# Altium project RESET_BOARD_OVER_RF24.PrjPcb
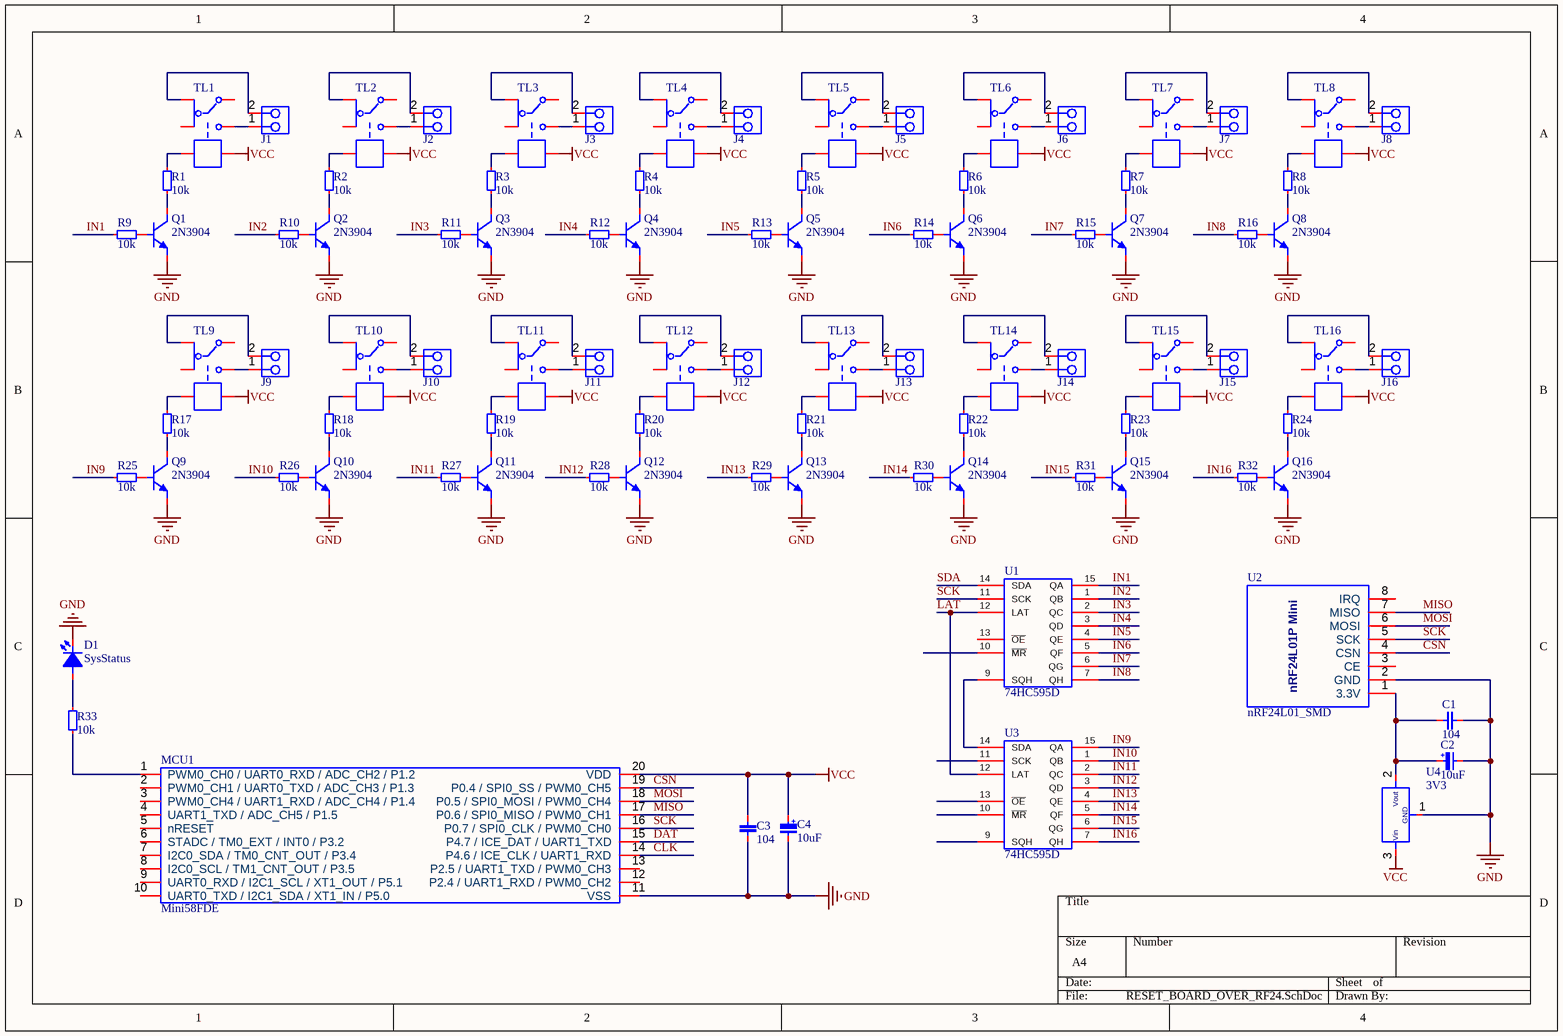
[diagram p0: RESET_BOARD_OVER_RF24.SchDoc]
1 sheet, 91 parts. Net scope: global (net labels, ports and power ports of the same name join across sheets).

## Sheet RESET_BOARD_OVER_RF24.SchDoc
size A4; SheetNumber: 1; SheetTotal: 1

### Parts
C1  104  [C1206]
C2  10uF  [CAP_RAD_D05x11]
C3  104  [C0805]
C4  10uF  [CAP_RAD_D05x11]
D1  SysStatus  [L0805RED]
J1  JST - XH - Thru (R) - 2.54mm  [JST - XH - Thru (R) - 2Pin - 2.54mm]  (value not drawn)
J2  JST - XH - Thru (R) - 2.54mm  [JST - XH - Thru (R) - 2Pin - 2.54mm]  (value not drawn)
J3  JST - XH - Thru (R) - 2.54mm  [JST - XH - Thru (R) - 2Pin - 2.54mm]  (value not drawn)
J4  JST - XH - Thru (R) - 2.54mm  [JST - XH - Thru (R) - 2Pin - 2.54mm]  (value not drawn)
J5  JST - XH - Thru (R) - 2.54mm  [JST - XH - Thru (R) - 2Pin - 2.54mm]  (value not drawn)
J6  JST - XH - Thru (R) - 2.54mm  [JST - XH - Thru (R) - 2Pin - 2.54mm]  (value not drawn)
J7  JST - XH - Thru (R) - 2.54mm  [JST - XH - Thru (R) - 2Pin - 2.54mm]  (value not drawn)
J8  JST - XH - Thru (R) - 2.54mm  [JST - XH - Thru (R) - 2Pin - 2.54mm]  (value not drawn)
J9  JST - XH - Thru (R) - 2.54mm  [JST - XH - Thru (R) - 2Pin - 2.54mm]  (value not drawn)
J10  JST - XH - Thru (R) - 2.54mm  [JST - XH - Thru (R) - 2Pin - 2.54mm]  (value not drawn)
J11  JST - XH - Thru (R) - 2.54mm  [JST - XH - Thru (R) - 2Pin - 2.54mm]  (value not drawn)
J12  JST - XH - Thru (R) - 2.54mm  [JST - XH - Thru (R) - 2Pin - 2.54mm]  (value not drawn)
J13  JST - XH - Thru (R) - 2.54mm  [JST - XH - Thru (R) - 2Pin - 2.54mm]  (value not drawn)
J14  JST - XH - Thru (R) - 2.54mm  [JST - XH - Thru (R) - 2Pin - 2.54mm]  (value not drawn)
J15  JST - XH - Thru (R) - 2.54mm  [JST - XH - Thru (R) - 2Pin - 2.54mm]  (value not drawn)
J16  JST - XH - Thru (R) - 2.54mm  [JST - XH - Thru (R) - 2Pin - 2.54mm]  (value not drawn)
MCU1  Mini58FDE  [TSSOP20_0.65_4.4]
Q1  2N3904  [SOT23-3]
Q2  2N3904  [SOT23-3]
Q3  2N3904  [SOT23-3]
Q4  2N3904  [SOT23-3]
Q5  2N3904  [SOT23-3]
Q6  2N3904  [SOT23-3]
Q7  2N3904  [SOT23-3]
Q8  2N3904  [SOT23-3]
Q9  2N3904  [SOT23-3]
Q10  2N3904  [SOT23-3]
Q11  2N3904  [SOT23-3]
Q12  2N3904  [SOT23-3]
Q13  2N3904  [SOT23-3]
Q14  2N3904  [SOT23-3]
Q15  2N3904  [SOT23-3]
Q16  2N3904  [SOT23-3]
R1  10k  [R0805]
R2  10k  [R0805]
R3  10k  [R0805]
R4  10k  [R0805]
R5  10k  [R0805]
R6  10k  [R0805]
R7  10k  [R0805]
R8  10k  [R0805]
R9  10k  [R0805]
R10  10k  [R0805]
R11  10k  [R0805]
R12  10k  [R0805]
R13  10k  [R0805]
R14  10k  [R0805]
R15  10k  [R0805]
R16  10k  [R0805]
R17  10k  [R0805]
R18  10k  [R0805]
R19  10k  [R0805]
R20  10k  [R0805]
R21  10k  [R0805]
R22  10k  [R0805]
R23  10k  [R0805]
R24  10k  [R0805]
R25  10k  [R0805]
R26  10k  [R0805]
R27  10k  [R0805]
R28  10k  [R0805]
R29  10k  [R0805]
R30  10k  [R0805]
R31  10k  [R0805]
R32  10k  [R0805]
R33  10k  [R0805]
TL1  HK4100F-DC3V-SHG  [RELAY-HK4100F-DC3V-SHG]  (value not drawn)
TL2  HK4100F-DC3V-SHG  [RELAY-HK4100F-DC3V-SHG]  (value not drawn)
TL3  HK4100F-DC3V-SHG  [RELAY-HK4100F-DC3V-SHG]  (value not drawn)
TL4  HK4100F-DC3V-SHG  [RELAY-HK4100F-DC3V-SHG]  (value not drawn)
TL5  HK4100F-DC3V-SHG  [RELAY-HK4100F-DC3V-SHG]  (value not drawn)
TL6  HK4100F-DC3V-SHG  [RELAY-HK4100F-DC3V-SHG]  (value not drawn)
TL7  HK4100F-DC3V-SHG  [RELAY-HK4100F-DC3V-SHG]  (value not drawn)
TL8  HK4100F-DC3V-SHG  [RELAY-HK4100F-DC3V-SHG]  (value not drawn)
TL9  HK4100F-DC3V-SHG  [RELAY-HK4100F-DC3V-SHG]  (value not drawn)
TL10  HK4100F-DC3V-SHG  [RELAY-HK4100F-DC3V-SHG]  (value not drawn)
TL11  HK4100F-DC3V-SHG  [RELAY-HK4100F-DC3V-SHG]  (value not drawn)
TL12  HK4100F-DC3V-SHG  [RELAY-HK4100F-DC3V-SHG]  (value not drawn)
TL13  HK4100F-DC3V-SHG  [RELAY-HK4100F-DC3V-SHG]  (value not drawn)
TL14  HK4100F-DC3V-SHG  [RELAY-HK4100F-DC3V-SHG]  (value not drawn)
TL15  HK4100F-DC3V-SHG  [RELAY-HK4100F-DC3V-SHG]  (value not drawn)
TL16  HK4100F-DC3V-SHG  [RELAY-HK4100F-DC3V-SHG]  (value not drawn)
U1  74HC595D  [SO16]
U2  nRF24L01_SMD  [NRF24L01Mini]
U3  74HC595D  [SO16]
U4  3V3  [SOT223-3]

### Nets
GND: C1.1 C2.2 C3.1 C4.2 D1.2(K) MCU1.11(VSS) Q1.2(E) Q2.2(E) Q3.2(E) Q4.2(E) Q5.2(E) Q6.2(E) Q7.2(E) Q8.2(E) Q9.2(E) Q10.2(E) Q11.2(E) Q12.2(E) Q13.2(E) Q14.2(E) Q15.2(E) Q16.2(E) U1.8 U2.2(GND) U3.8 U4.1
VCC: C3.2 C4.1 MCU1.20(VDD) TL1.5 TL2.5 TL3.5 TL4.5 TL5.5 TL6.5 TL7.5 TL8.5 TL9.5 TL10.5 TL11.5 TL12.5 TL13.5 TL14.5 TL15.5 TL16.5 U1.16 U3.16 U4.3
CLK: MCU1.14(P4.6_/_ICE_CLK_/_UART1_RXD)
CSN: MCU1.19(P0.4_/_SPI0_SS_/_PWM0_CH5) U2.4(CSN)
DAT: MCU1.15(P4.7_/_ICE_DAT_/_UART1_TXD)
IN1: R9.1 U1.15(QA)
IN2: R10.1 U1.1(QB)
IN3: R11.1 U1.2(QC)
IN4: R12.1 U1.3(QD)
IN5: R13.1 U1.4(QE)
IN6: R14.1 U1.5(QF)
IN7: R15.1 U1.6(QG)
IN8: R16.1 U1.7(QH)
IN9: R25.1 U3.15(QA)
IN10: R26.1 U3.1(QB)
IN11: R27.1 U3.2(QC)
IN12: R28.1 U3.3(QD)
IN13: R29.1 U3.4(QE)
IN14: R30.1 U3.5(QF)
IN15: R31.1 U3.6(QG)
IN16: R32.1 U3.7(QH)
LAT: U1.12(LAT) U3.12(LAT)
MISO: MCU1.17(P0.6_/_SPI0_MISO_/_PWM0_CH1) U2.7(MISO)
MOSI: MCU1.18(P0.5_/_SPI0_MOSI_/_PWM0_CH4) U2.6(MOSI)
SCK: MCU1.16(P0.7_/_SPI0_CLK_/_PWM0_CH0) U1.11(SCK) U2.5(SCK)
SDA: U1.14(SDA)
NetC1_2: C1.2 C2.1 U2.1(3.3V) U4.2
NetD1_1: D1.1(A) R33.1
NetJ1_1: J1.1 TL1.3
NetJ1_2: J1.2 TL1.1
NetJ2_1: J2.1 TL2.3
NetJ2_2: J2.2 TL2.1
NetJ3_1: J3.1 TL3.3
NetJ3_2: J3.2 TL3.1
NetJ4_1: J4.1 TL4.3
NetJ4_2: J4.2 TL4.1
NetJ5_1: J5.1 TL5.3
NetJ5_2: J5.2 TL5.1
NetJ6_1: J6.1 TL6.3
NetJ6_2: J6.2 TL6.1
NetJ7_1: J7.1 TL7.3
NetJ7_2: J7.2 TL7.1
NetJ8_1: J8.1 TL8.3
NetJ8_2: J8.2 TL8.1
NetJ9_1: J9.1 TL9.3
NetJ9_2: J9.2 TL9.1
NetJ10_1: J10.1 TL10.3
NetJ10_2: J10.2 TL10.1
NetJ11_1: J11.1 TL11.3
NetJ11_2: J11.2 TL11.1
NetJ12_1: J12.1 TL12.3
NetJ12_2: J12.2 TL12.1
NetJ13_1: J13.1 TL13.3
NetJ13_2: J13.2 TL13.1
NetJ14_1: J14.1 TL14.3
NetJ14_2: J14.2 TL14.1
NetJ15_1: J15.1 TL15.3
NetJ15_2: J15.2 TL15.1
NetJ16_1: J16.1 TL16.3
NetJ16_2: J16.2 TL16.1
NetMCU1_1: MCU1.1(PWM0_CH0_/_UART0_RXD_/_ADC_CH2_/_P1.2) R33.2
NetQ1_1: Q1.1(B) R9.2
NetQ1_3: Q1.3(C) R1.1
NetQ2_1: Q2.1(B) R10.2
NetQ2_3: Q2.3(C) R2.1
NetQ3_1: Q3.1(B) R11.2
NetQ3_3: Q3.3(C) R3.1
NetQ4_1: Q4.1(B) R12.2
NetQ4_3: Q4.3(C) R4.1
NetQ5_1: Q5.1(B) R13.2
NetQ5_3: Q5.3(C) R5.1
NetQ6_1: Q6.1(B) R14.2
NetQ6_3: Q6.3(C) R6.1
NetQ7_1: Q7.1(B) R15.2
NetQ7_3: Q7.3(C) R7.1
NetQ8_1: Q8.1(B) R16.2
NetQ8_3: Q8.3(C) R8.1
NetQ9_1: Q9.1(B) R25.2
NetQ9_3: Q9.3(C) R17.1
NetQ10_1: Q10.1(B) R26.2
NetQ10_3: Q10.3(C) R18.1
NetQ11_1: Q11.1(B) R27.2
NetQ11_3: Q11.3(C) R19.1
NetQ12_1: Q12.1(B) R28.2
NetQ12_3: Q12.3(C) R20.1
NetQ13_1: Q13.1(B) R29.2
NetQ13_3: Q13.3(C) R21.1
NetQ14_1: Q14.1(B) R30.2
NetQ14_3: Q14.3(C) R22.1
NetQ15_1: Q15.1(B) R31.2
NetQ15_3: Q15.3(C) R23.1
NetQ16_1: Q16.1(B) R32.2
NetQ16_3: Q16.3(C) R24.1
NetR1_2: R1.2 TL1.2
NetR2_2: R2.2 TL2.2
NetR3_2: R3.2 TL3.2
NetR4_2: R4.2 TL4.2
NetR5_2: R5.2 TL5.2
NetR6_2: R6.2 TL6.2
NetR7_2: R7.2 TL7.2
NetR8_2: R8.2 TL8.2
NetR17_2: R17.2 TL9.2
NetR18_2: R18.2 TL10.2
NetR19_2: R19.2 TL11.2
NetR20_2: R20.2 TL12.2
NetR21_2: R21.2 TL13.2
NetR22_2: R22.2 TL14.2
NetR23_2: R23.2 TL15.2
NetR24_2: R24.2 TL16.2
NetU1_9: U1.9(SQH) U3.14(SDA)

Not connected (* = marked no-connect by the designer): MCU1 2(PWM0_CH1_/_UART0_TXD_/_ADC_CH3_/_P1.3) 3(PWM0_CH4_/_UART1_RXD_/_ADC_CH4_/_P1.4) 4(UART1_TXD_/_ADC_CH5_/_P1.5) 5(nRESET) 6(STADC_/_TM0_EXT_/_INT0_/_P3.2) 7(I2C0_SDA_/_TM0_CNT_OUT_/_P3.4) 8(I2C0_SCL_/_TM1_CNT_OUT_/_P3.5) 9(UART0_RXD_/_I2C1_SCL_/_XT1_OUT_/_P5.1) 10(UART0_TXD_/_I2C1_SDA_/_XT1_IN_/_P5.0) 12(P2.4_/_UART1_RXD_/_PWM0_CH2) 13(P2.5_/_UART1_TXD_/_PWM0_CH3); TL1 4 6; TL2 4 6; TL3 4 6; TL4 4 6; TL5 4 6; TL6 4 6; TL7 4 6; TL8 4 6; TL9 4 6; TL10 4 6; TL11 4 6; TL12 4 6; TL13 4 6; TL14 4 6; TL15 4 6; TL16 4 6; U1 10(~{MR}) 13(~{OE}); U2 3(CE) 8(IRQ); U3 9(SQH) 10(~{MR}) 11(SCK) 13(~{OE})

### Notes on the sheet
- (in symbol Capacitor(Radian)) +
- (in symbol Ic-AMS1117(SOT-223)) Vout; GND; Vin
- (in symbol Module-nRF24L01_SMD) nRF24L01P Mini

### Library data of the parts
C1 C3 = Capacitors(SMD)
C2 C4 = Capacitor(Radian)
D1 = LED0805
J1-J16 = JST - XH - Thru (R) - 2Pin - 2.54mm
MCU1 = Mcu-Mini58FDE: Novoton 4Kb-RAM 32Kb-Flash
Q1-Q16 = Transistor-2N3904 (SOT-23)
R1-R33 = Resistors-SMD
TL1-TL16 = Relay-HK4100F-DC3V-SHG
U1 U3 = Ic-74HC595D
U2 = Module-nRF24L01_SMD
U4 = Ic-AMS1117(SOT-223)